# EAGLE design half-kw-batpack (EAGLE 7.1.0)

## Sheet 1 of 2
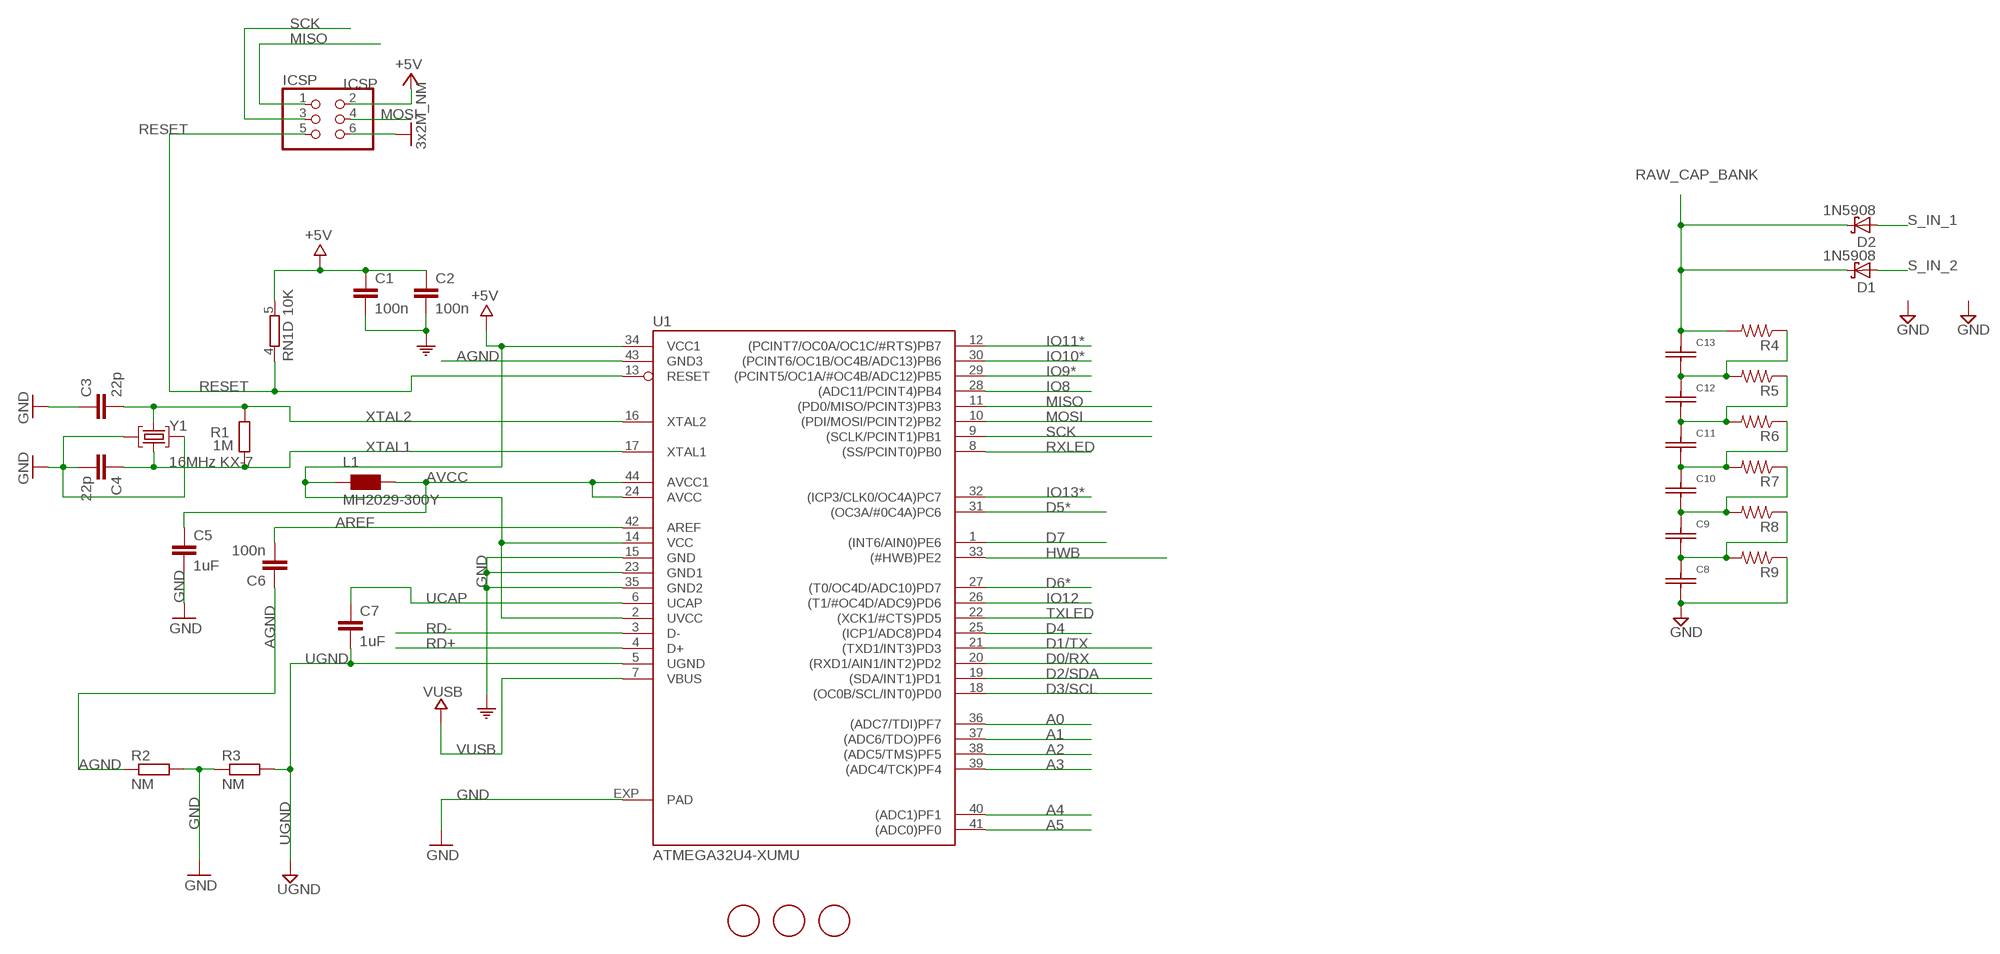
[diagram p0: schematic, sheet 1]

### Parts
C1  100n  C-EUC0603  [C0603-ROUND]
C2  100n  C-EUC0603  [C0603-ROUND]
C3  22p  C-EUC0603  [C0603-ROUND]
C4  22p  C-EUC0603  [C0603-ROUND]
C5  1uF  C-EUC0603  [C0603-ROUND]
C6  100n  C-EUC0603  [C0603-ROUND]
C7  1uF  C-EUC0603  [C0603-ROUND]
C8  BCAP0100  [MAXWELLBCAP100]
C9  BCAP0100  [MAXWELLBCAP100]
C10  BCAP0100  [MAXWELLBCAP100]
C11  BCAP0100  [MAXWELLBCAP100]
C12  BCAP0100  [MAXWELLBCAP100]
C13  BCAP0100  [MAXWELLBCAP100]
D1  1N5908  [C4111-15]
D2  1N5908  [C4111-15]
FID1  FIDUCIALMOUNT  [FIDUCIA-MOUNT]
FID2  FIDUCIALMOUNT  [FIDUCIA-MOUNT]
FID3  FIDUCIALMOUNT  [FIDUCIA-MOUNT]
ICSP  ICSP  PINHD-2X3  [2X03]
L1  MH2029-300Y  WE-CBF_0805  [0805]
R1  1M  R-EU_R0603  [R0603-ROUND]
R2  NM  R-EU_R0402  [R0402]
R3  NM  R-EU_R0402  [R0402]
R4  R-US_R1206  [R1206]
R5  R-US_R1206  [R1206]
R6  R-US_R1206  [R1206]
R7  R-US_R1206  [R1206]
R8  R-US_R1206  [R1206]
R9  R-US_R1206  [R1206]
RN1  10K  4R-NCAY16  [CAY16]
U1  ATMEGA32U4-XUMU  [QFN44ML7X7]
Y1  16MHz KX-7  CRYSTAL-3.2-2.5  [CRYSTAL-3.2-2.5]

### Nets
+5V [usbvcc]: C1.1 C2.1 ICSP.2 L1.1 RN1.5 U1.2(UVCC) U1.14(VCC) U1.34(VCC1)
A0: U1.36((ADC7/TDI)PF7)
A1: U1.37((ADC6/TDO)PF6)
A2: U1.38((ADC5/TMS)PF5)
A3: U1.39((ADC4/TCK)PF4)
A4: U1.40((ADC1)PF1)
A5: U1.41((ADC0)PF0)
AGND: C6.1 R2.1 U1.43(GND3)
AREF [aref]: C6.2 U1.42(AREF)
AVCC: C5.1 L1.2 U1.24(AVCC) U1.44(AVCC1)
D0/RX: U1.20((RXD1/AIN1/INT2)PD2)
D1/TX: U1.21((TXD1/INT3)PD3)
D2/SDA: U1.19((SDA/INT1)PD1)
D3/SCL: U1.18((OC0B/SCL/INT0)PD0)
D4: U1.25((ICP1/ADC8)PD4)
D5*: U1.31((OC3A/#0C4A)PC6)
D6*: U1.27((T0/OC4D/ADC10)PD7)
D7: U1.1((INT6/AIN0)PE6)
GND [gnd]: C1.2 C2.2 C3.1 C4.2 C5.2 C8.P$2 ICSP.6 R2.2 R3.1 R9.1 U1.15(GND) U1.23(GND1) U1.35(GND2) U1.EXP(PAD) Y1.2(GND) Y1.4(GND) ; supply symbol labelled 3x2M_NM, COM
HWB: U1.33((#HWB)PE2)
IO8: U1.28((ADC11/PCINT4)PB4)
IO9*: U1.29((PCINT5/OC1A/#OC4B/ADC12)PB5)
IO10*: U1.30((PCINT6/OC1B/OC4B/ADC13)PB6)
IO11*: U1.12((PCINT7/OC0A/OC1C/#RTS)PB7)
IO12: U1.26((T1/#OC4D/ADC9)PD6)
IO13*: U1.32((ICP3/CLK0/OC4A)PC7)
MISO: ICSP.1 U1.11((PD0/MISO/PCINT3)PB3)
MOSI: ICSP.4 U1.10((PDI/MOSI/PCINT2)PB2)
N$2: C9.P$1 C10.P$2 R7.1 R8.2
N$3: C10.P$1 C11.P$2 R6.1 R7.2
N$7: C12.P$1 C13.P$2 R4.1 R5.2
N$8: C11.P$1 C12.P$2 R5.1 R6.2
N$11: C8.P$1 C9.P$2 R8.1 R9.2
RAW_CAP_BANK: C13.P$1 D1.C D2.C R4.2
RD+: U1.4(D+)
RD-: U1.3(D-)
RESET: ICSP.5 RN1.4 U1.13(RESET)
RXLED: U1.8((SS/PCINT0)PB0)
S_IN_1: D2.A
S_IN_2: D1.A
SCK: ICSP.3 U1.9((SCLK/PCINT1)PB1)
TXLED: U1.22((XCK1/#CTS)PD5)
UCAP: C7.1 U1.6(UCAP)
UGND [gnd]: C7.2 R3.2 U1.5(UGND)
VUSB: U1.7(VBUS)
XTAL1: C4.1 R1.1 U1.17(XTAL1) Y1.1(C1)
XTAL2: C3.2 R1.2 U1.16(XTAL2) Y1.3(C2)
Unconnected: RN1.1 RN1.2 RN1.3 RN1.6 RN1.7 RN1.8

## Sheet 2 of 2
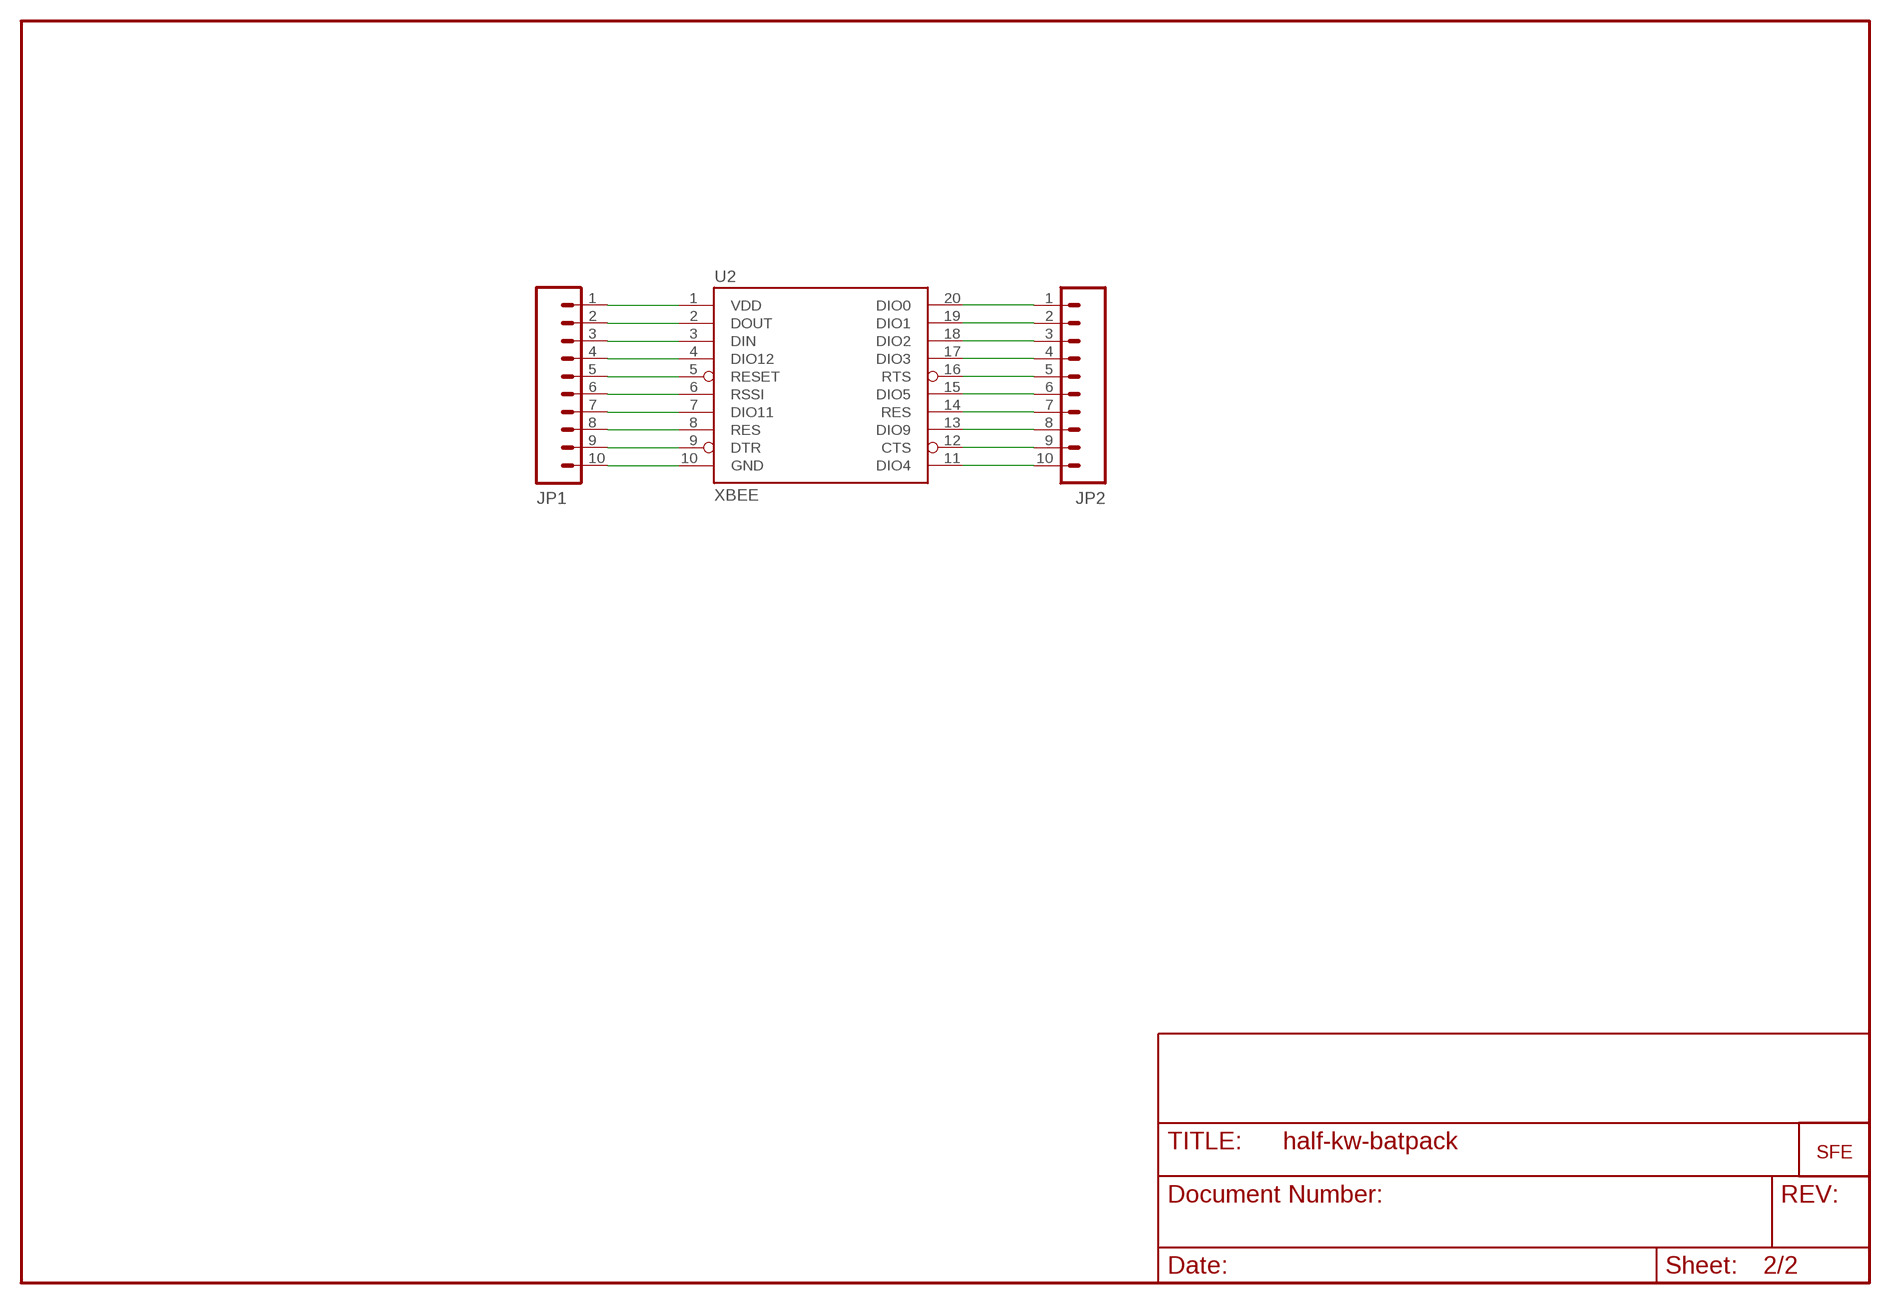
[diagram p1: schematic, sheet 2]

### Parts
JP1  M100.1  [1X10]
JP2  M100.1  [1X10]
U2  XBEE  XBEE-1B1  [XBEE-1]
U$2  LOGO-SFENEW  [SFE-NEW-WEBLOGO]

### Nets
N$1: JP1.5 U2.5(RESET)
N$21: JP1.1 U2.1(VDD)
N$22: JP1.2 U2.2(DOUT)
N$23: JP1.3 U2.3(DIN)
N$24: JP1.4 U2.4(DIO12)
N$26: JP1.6 U2.6(RSSI)
N$27: JP1.7 U2.7(DIO11)
N$28: JP1.8 U2.8(RES)
N$29: JP1.9 U2.9(DTR)
N$30: JP1.10 U2.10(GND)
N$31: JP2.10 U2.11(DIO4)
N$32: JP2.9 U2.12(CTS)
N$33: JP2.8 U2.13(DIO9)
N$34: JP2.7 U2.14(RES)
N$35: JP2.6 U2.15(DIO5)
N$36: JP2.5 U2.16(RTS)
N$37: JP2.4 U2.17(DIO3)
N$38: JP2.3 U2.18(DIO2)
N$39: JP2.2 U2.19(DIO1)
N$40: JP2.1 U2.20(DIO0)

## Library data of the parts
C1-C7 = SmartPrj:C-EU: CAPACITOR, European symbol
C8-C13 = passives:BCAP0100; MFG: maxwell; MFN: BCAP0100 P270 T01
D1 D2 = diode:1N5908: DIODE schottky
FID1-FID3 = SmartPrj:FIDUCIALMOUNT
ICSP = SmartPrj:PINHD-2X3: PIN HEADER
JP1 JP2 = SparkFun:M10: Header 10 Standard 10-pin 0.1" header. Use with straight break away headers (SKU : PRT-00116), right angle break away headers (PRT-00553), swiss pins (PRT-00743), machine pins (PRT-00117), and female headers (PRT-00115).
L1 = wuerth-elektronik:WE-CBF: SMD EMI Suppression Ferrite Beads - excellent anti-EMI properties - low DCR - impedances till 3000 ohms - rated current up to 6 A
R1-R3 = SmartPrj:R-EU_: RESISTOR, European symbol
R4-R9 = rcl:R-US_: RESISTOR, American symbol
RN1 = resistor-dil:4R-N: Array Chip Resistor Source: RS Component / Phycomp
U1 = SmartPrj:ATMEGA32U4-XU
U2 = SparkFun:XBEE-1
U$2 = SparkFun:LOGO-SFE: Spark Fun Electronics PCB Logo This is the standard Spark Fun Electronics PCB logo.
Y1 = SmartPrj:CRYSTAL-3.2-2.5

## Net classes
0 default: width 0.254 mm
1 power: width 0.254 mm, drill 0.61 mm, clearance 0.254 mm
2 gnd: width 0.254 mm, drill 0.61 mm, clearance 0.254 mm
3 usbvcc: width 0.254 mm, drill 0.61 mm, clearance 0.254 mm
4 aref: width 0.254 mm, drill 0.61 mm, clearance 0.254 mm

## Board
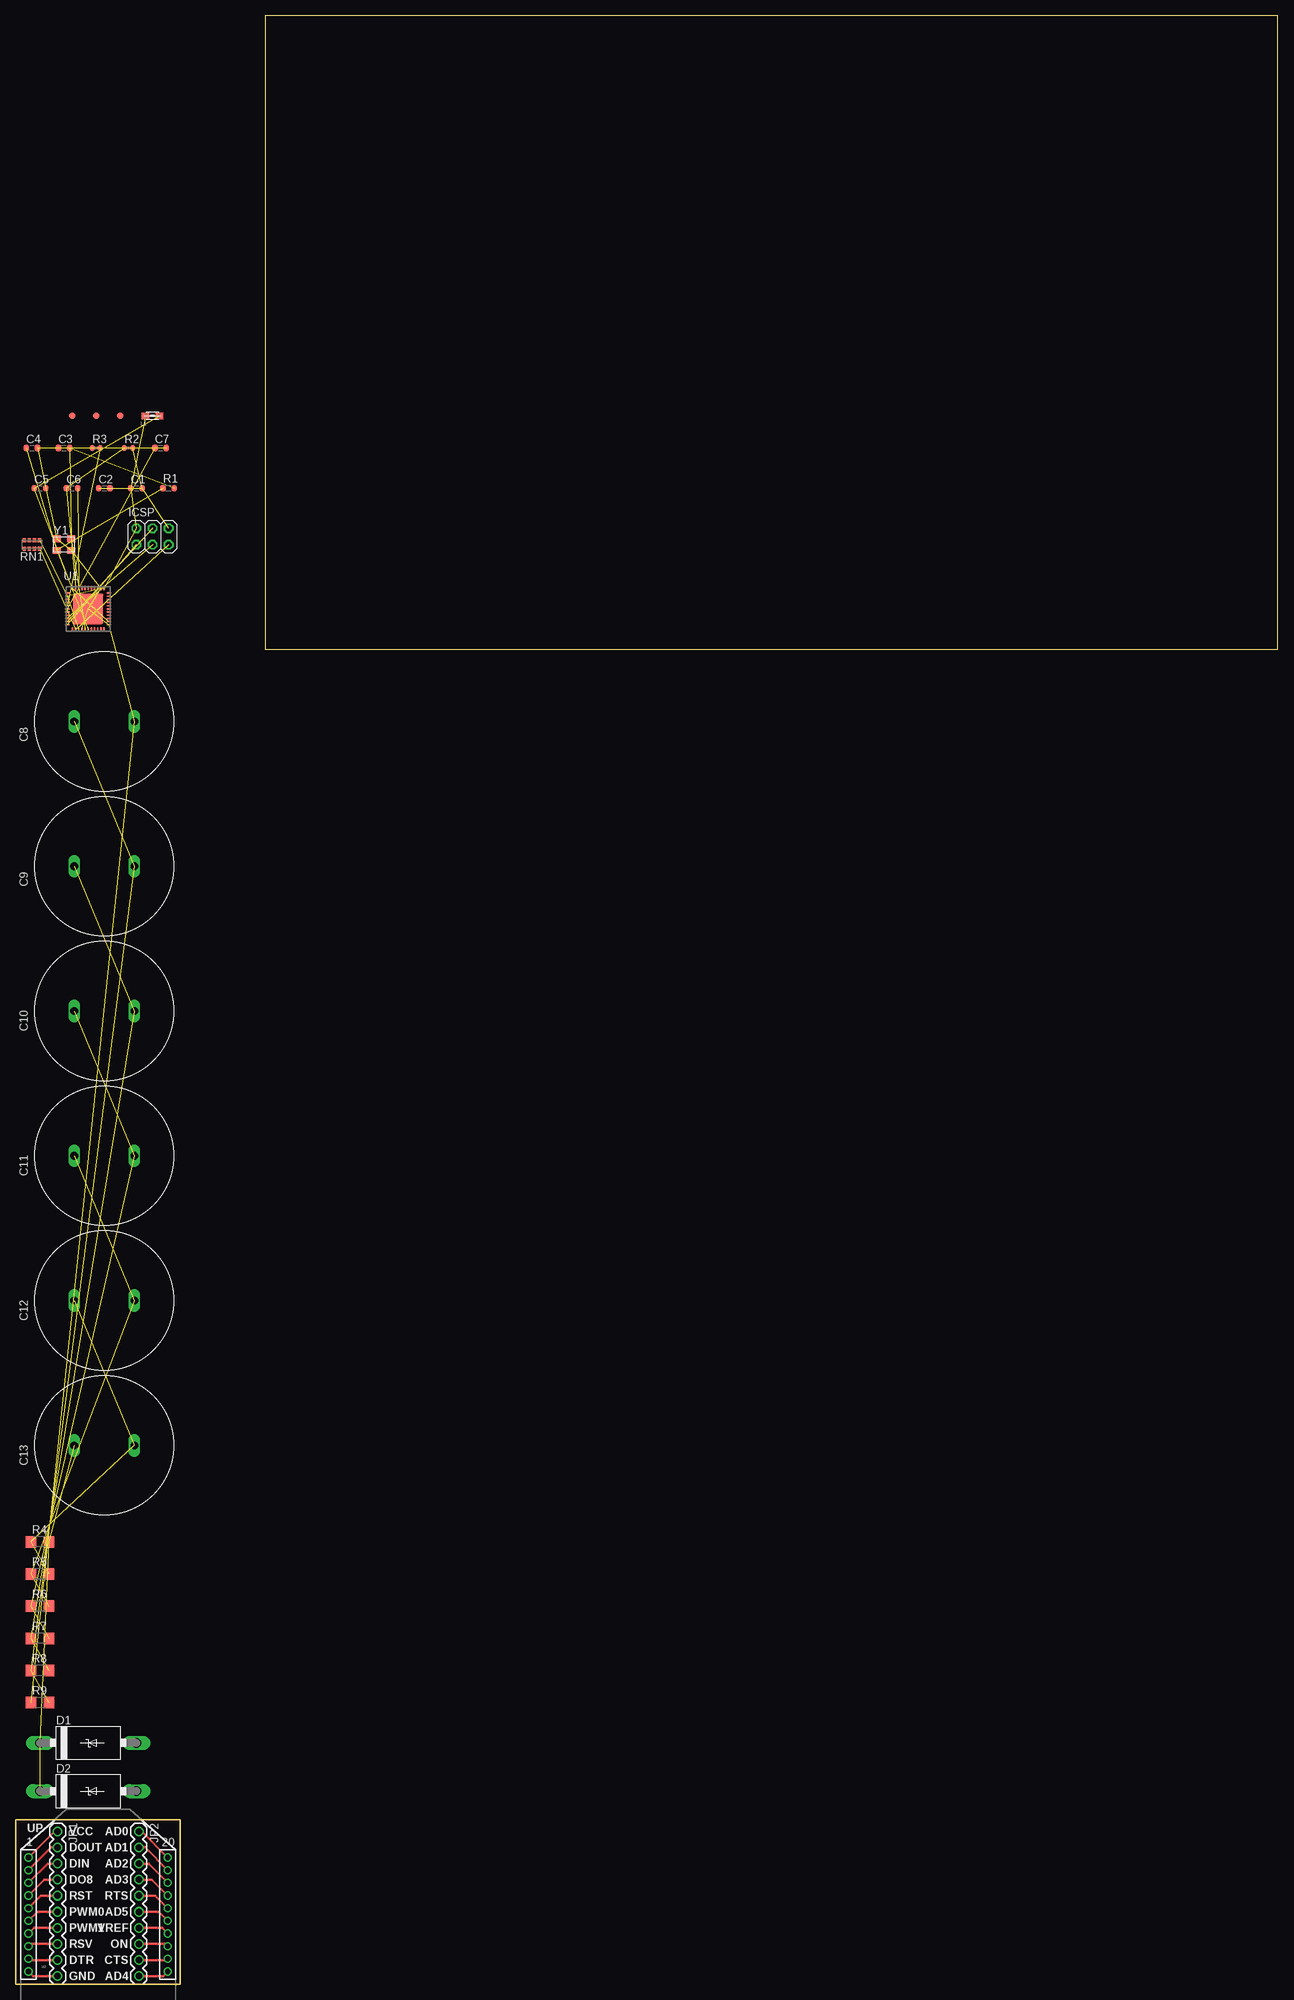
[diagram p2: board, top side]
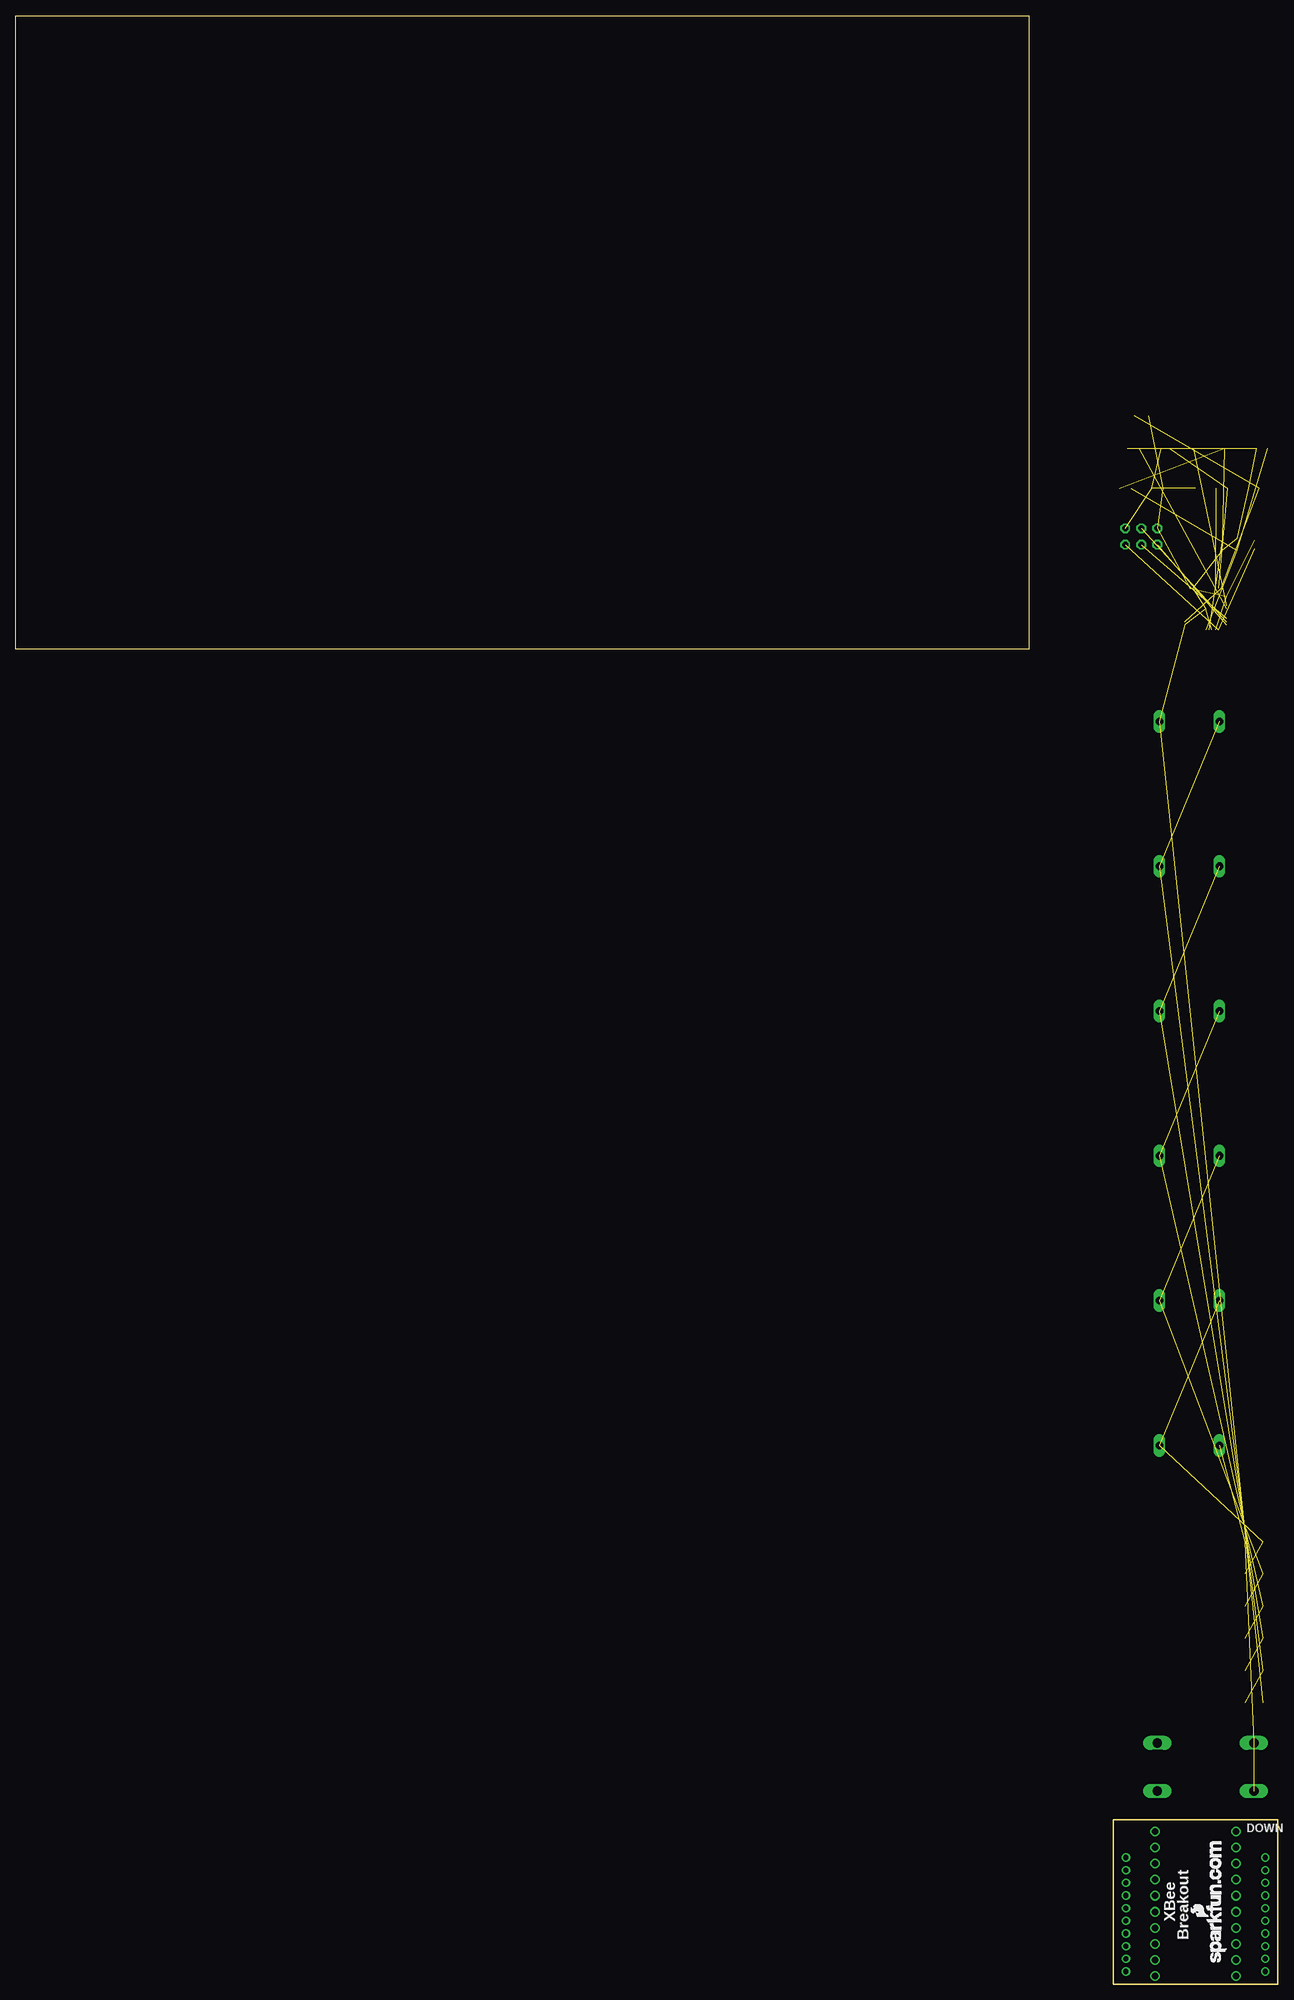
[diagram p3: board, bottom side, seen from below]

Size 199.37 x 310.82 mm. Coordinates in mm from the lower left corner, seen from the top.
Outline: 39.37,210.82 199.37,210.82 199.37,310.82 39.37,310.82 39.37,210.82
Outline: 0,26 26,26 26,0 0,0 0,26
Copper layers (1*16): Top 0.035mm / dielectric 1.5mm / Bottom 0.035mm
Design rules "default": minimum track width 10mil, minimum drill 24mil, track to track 8mil, track to pad 8mil, pad to pad 8mil, via to via 8mil, smd to smd 8mil, copper to edge 40mil, drill to drill 8mil, minimum pad ring 10mil, minimum via ring 8mil, stop-mask expansion 4mil, vias tented up to drill 0mil, thermal gap 10mil

### Footprints (pad centres in the part's own frame; a part is rotated, then mirrored left to right if it is on the bottom)
C0603-ROUND = smd 0.898 x 1.1: 1 -0.889,0; 2 0.889,0
MAXWELLBCAP100 = drill 1.2 long: P$1 -4.75,0; P$2 4.75,0
C4111-15 = drill 1.499 long: A 7.62,0; C -7.62,0
FIDUCIA-MOUNT = smd 1.016 x 1.016: P$1 0,0
2X03 = drill 0.95 pad 1.55 octagon: 1 -2.54,-1.27; 2 -2.54,1.27; 3 0,-1.27; 4 0,1.27; 5 2.54,-1.27; 6 2.54,1.27
1X10 = drill 1.016: 1 0,0; 2 2.54,0; 3 5.08,0; 4 7.62,0; 5 10.16,0; 6 12.7,0; 7 15.24,0; 8 17.78,0; 9 20.32,0; 10 22.86,0
0805 = smd 1.2 x 1: 1 -1.1,0; 2 1.1,0
R0603-ROUND = smd 0.898 x 1.1: 1 -0.889,0; 2 0.889,0
R0402 = smd 0.7 x 0.9: 1 -0.65,0; 2 0.65,0
R1206 = smd 1.6 x 1.803: 1 -1.422,0; 2 1.422,0
CAY16 = smd 0.5 x 0.65: 1 -1.2,-0.675; 2 -0.4,-0.675; 3 0.4,-0.675; 4 1.2,-0.675; 5 1.2,0.675; 6 0.4,0.675; 7 -0.4,0.675; 8 -1.2,0.675
QFN44ML7X7 = smd 0.75 x 0.275: 1 -3.275,2.5; 2 -3.275,2; 3 -3.275,1.5; 4 -3.275,1; 5 -3.275,0.5; 6 -3.275,0; 7 -3.275,-0.5; 8 -3.275,-1; 9 -3.275,-1.5; 10 -3.275,-2; 11 -3.275,-2.5; 23 3.275,-2.5; 24 3.275,-2; 25 3.275,-1.5; 26 3.275,-1; 27 3.275,-0.5; 28 3.275,0; 29 3.275,0.5; 30 3.275,1; 31 3.275,1.5; 32 3.275,2; 33 3.275,2.5 | smd 0.275 x 0.75: 12 -2.5,-3.275; 13 -2,-3.275; 14 -1.5,-3.275; 15 -1,-3.275; 16 -0.5,-3.275; 17 0,-3.275; 18 0.5,-3.275; 19 1,-3.275; 20 1.5,-3.275; 21 2,-3.275; 22 2.5,-3.275; 34 2.5,3.275; 35 2,3.275; 36 1.5,3.275; 37 1,3.275; 38 0.5,3.275; 39 0,3.275; 40 -0.5,3.275; 41 -1,3.275; 42 -1.5,3.275; 43 -2,3.275; 44 -2.5,3.275 | smd 4.826 x 4.826: EXP 0,0
XBEE-1 = drill 0.8: 1 -11,20; 2 -11,18; 3 -11,16; 4 -11,14; 5 -11,12; 6 -11,10; 7 -11,8; 8 -11,6; 9 -11,4; 10 -11,2; 11 11,2; 12 11,4; 13 11,6; 14 11,8; 15 11,10; 16 11,12; 17 11,14; 18 11,16; 19 11,18; 20 11,20
CRYSTAL-3.2-2.5 = smd 1.3 x 1.05: 1 -1.15,-0.925; 2 1.15,-0.925; 3 1.15,0.925; 4 -1.15,0.925

### Placement (x,y rotation side)
C1  19.05,236.22 0 top
C2  13.97,236.22 0 top
C3  7.62,242.57 0 top
C4  2.54,242.57 0 top
C5  3.81,236.22 0 top
C6  8.89,236.22 0 top
C7  22.86,242.57 0 top
C8  13.97,199.39 0 top
C9  13.97,176.53 0 top
C10  13.97,153.67 0 top
C11  13.97,130.81 0 top
C12  13.97,107.95 0 top
C13  13.97,85.09 0 top
D1  11.43,38.1 0 top
D2  11.43,30.48 0 top
FID1  16.51,247.65 0 top
FID2  12.7,247.65 0 top
FID3  8.89,247.65 0 top
ICSP  21.59,228.6 0 top
JP1  6.6,24.13 270 top
JP2  19.43,24.13 270 top
L1  21.59,247.65 0 top
R1  24.13,236.22 0 top
R2  17.78,242.57 0 top
R3  12.7,242.57 0 top
R4  3.81,69.85 0 top
R5  3.81,64.77 0 top
R6  3.81,59.69 0 top
R7  3.81,54.61 0 top
R8  3.81,49.53 0 top
R9  3.81,44.45 0 top
RN1  2.54,227.33 0 top
U1  11.43,217.17 0 top
U2  13,0 0 top
U$2  8.1,3.5 90 bottom
Y1  7.62,227.33 0 top

### Tracks (layer width: path | path; a pad name or v marks a point on that pad's centre or on a via)
+5V  (7 unrouted)
AGND  (2 unrouted)
AREF  (1 unrouted)
AVCC  (3 unrouted)
GND  (15 unrouted)
MISO  (1 unrouted)
MOSI  (1 unrouted)
N$1
  Top 0.406: U2.5 3.97,13.97 JP1.5
N$2  (3 unrouted)
N$3  (3 unrouted)
N$7  (3 unrouted)
N$8  (3 unrouted)
N$11  (3 unrouted)
N$21
  Top 0.406: U2.1 6.13,24.13 JP1.1
N$22
  Top 0.406: U2.2 5.59,21.59 JP1.2
N$23
  Top 0.406: U2.3 5.05,19.05 JP1.3
N$24
  Top 0.406: U2.4 4.51,16.51 JP1.4
N$26
  Top 0.406: U2.6 3.43,11.43 JP1.6
N$27
  Top 0.406: U2.7 2.89,8.89 JP1.7
N$28
  Top 0.406: U2.8 2.35,6.35 JP1.8
N$29
  Top 0.406: U2.9 2.19,3.81 JP1.9
N$30
  Top 0.406: U2.10 2.73,1.27 JP1.10
N$31
  Top 0.406: U2.11 23.27,1.27 JP2.10
N$32
  Top 0.406: U2.12 23.81,3.81 JP2.9
N$33
  Top 0.406: U2.13 23.65,6.35 JP2.8
N$34
  Top 0.406: U2.14 23.11,8.89 JP2.7
N$35
  Top 0.406: U2.15 22.57,11.43 JP2.6
N$36
  Top 0.406: U2.16 22.03,13.97 JP2.5
N$37
  Top 0.406: U2.17 21.49,16.51 JP2.4
N$38
  Top 0.406: U2.18 20.95,19.05 JP2.3
N$39
  Top 0.406: U2.19 20.41,21.59 JP2.2
N$40
  Top 0.406: U2.20 19.87,24.13 JP2.1
RAW_CAP_BANK  (3 unrouted)
RESET  (2 unrouted)
SCK  (1 unrouted)
UCAP  (1 unrouted)
UGND  (2 unrouted)
XTAL1  (3 unrouted)
XTAL2  (3 unrouted)

### Text on the board
tPlace: AD0 | UP | VCC | 1 | AD1 | 20 | DOUT | AD2 | DIN | AD3 | DO8 | RTS | RST | AD5 | PWM0 | VREF | PWM1 | ON | RSV | CTS | DTR | AD4 | GND
bPlace: DOWN | XBee | Breakout